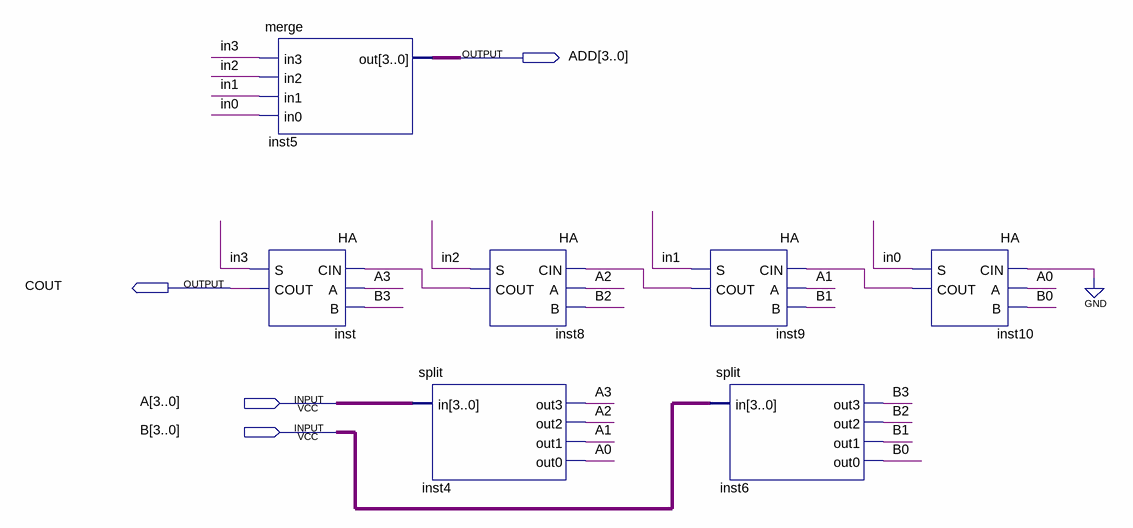
[diagram p0: schematic sheet]
// Quartus schematic FA.bdf as structural Verilog: 7 symbols, 4 pins
module FA (
  input  [3:0] A,
  input  [3:0] B,
  output [3:0] ADD,
  output COUT
);

  wire in0, in1, in2, in3, inst8_cout, inst9_cout, inst10_cout;

  merge inst5 (.in3(in3), .in2(in2), .in1(in1), .in0(in0), .out(ADD));
  HA inst (.CIN(inst8_cout), .A(A[3]), .B(B[3]), .S(in3), .COUT(COUT));
  HA inst8 (.CIN(inst9_cout), .A(A[2]), .B(B[2]), .S(in2), .COUT(inst8_cout));
  split inst4 (.in(A), .out3(A[3]), .out2(A[2]), .out1(A[1]), .out0(A[0]));
  HA inst9 (.CIN(inst10_cout), .A(A[1]), .B(B[1]), .S(in1), .COUT(inst9_cout));
  split inst6 (.in(B), .out3(B[3]), .out2(B[2]), .out1(B[1]), .out0(B[0]));
  HA inst10 (.CIN(1'b0), .A(A[0]), .B(B[0]), .S(in0), .COUT(inst10_cout));
endmodule
